# Altium project LCR.PrjPcb
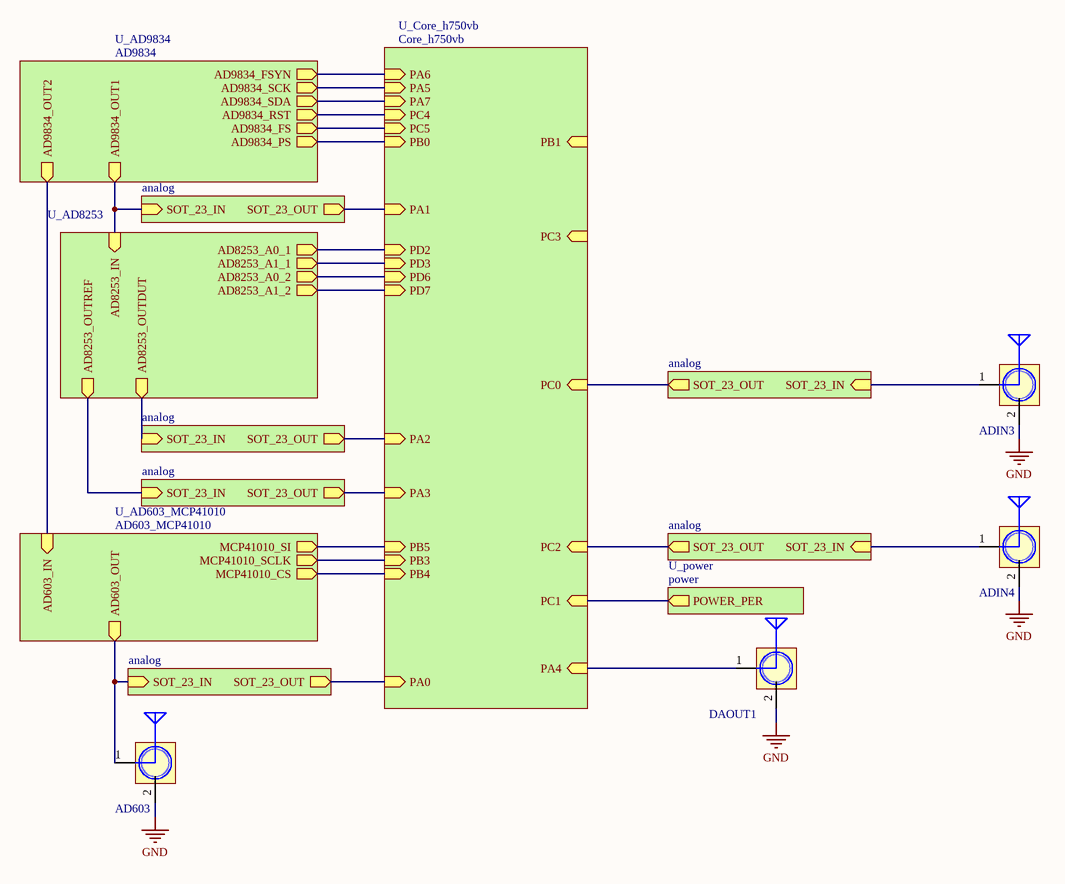
[diagram p0: Main.SchDoc]
8 sheets, 522 parts. Net scope: hierarchical (ports join the sheet entries above them; power ports are global).
Board file: LCR.PcbDoc
Sheets:
  Main.SchDoc
    U_AD603_MCP41010 = AD603_MCP41010.SchDoc
    U_AD8253 = AD8253.SchDoc
    U_AD9834 = AD9834.SchDoc
     = analog.SchDoc
    U_Core_h750vb = Core_h750vb.SchDoc
    U_power = power.SchDoc
     = analog.SchDoc
     = analog.SchDoc
     = analog.SchDoc
     = analog.SchDoc
     = analog.SchDoc
  Sheet1.SchDoc
    U_AD603_MCP41010 = AD603_MCP41010.SchDoc
    U_AD8253 = AD8253.SchDoc
    U_AD9834 = AD9834.SchDoc
    U_Core_h750vb = Core_h750vb.SchDoc
    U_power = power.SchDoc
     = analog.SchDoc
     = analog.SchDoc

## Sheet Main.SchDoc
size A4

### Parts
AD603  SMA WIFI 天线接口  [SMA]  (value not drawn)
ADIN3  SMA WIFI 天线接口  [SMA]  (value not drawn)
ADIN4  SMA WIFI 天线接口  [SMA]  (value not drawn)
DAOUT1  SMA WIFI 天线接口  [SMA]  (value not drawn)

### Sub-sheets
U_AD603_MCP41010 = AD603_MCP41010: AD603_OUT (out), MCP41010_SI (out), MCP41010_SCLK (out), MCP41010_CS (out), AD603_IN (in)
U_AD8253 = AD8253: AD8253_A0_1 (out), AD8253_A1_1 (out), AD8253_A0_2 (out), AD8253_A1_2 (out), AD8253_OUTDUT (out), AD8253_OUTREF (out), AD8253_IN (in)
U_AD9834 = AD9834: AD9834_FSYN (out), AD9834_SCK (out), AD9834_SDA (out), AD9834_RST (out), AD9834_FS (out), AD9834_PS (out), AD9834_OUT1 (out), AD9834_OUT2 (out)
U_Core_h750vb = Core_h750vb: PA6 (in), PA5 (in), PA7 (in), PC4 (in), PC5 (in), PB0 (in), PB5 (in), PB3 (in), PD2 (in), PD3 (in), PD6 (in), PD7 (in), PA1 (in), PA2 (in), PA3 (in), PC0 (in), PC1 (in), PC2 (in), PC3 (in), PA0 (in), PB1 (in), PB4 (in), PA4 (in)
U_power = power: POWER_PER (out)
? = analog: SOT_23_OUT (out), SOT_23_IN (in)
? = analog: SOT_23_OUT (out), SOT_23_IN (in)
? = analog: SOT_23_IN (in), SOT_23_OUT (out)
? = analog: SOT_23_IN (in), SOT_23_OUT (out)
? = analog: SOT_23_IN (in), SOT_23_OUT (out)
? = analog: SOT_23_IN (in), SOT_23_OUT (out)

### Nets
GND: AD603.2 ADIN3.2 ADIN4.2 DAOUT1.2
A0_1: sheet U_AD8253/AD8253_A0_1, sheet U_Core_h750vb/PD2
A0_2: sheet U_AD8253/AD8253_A0_2, sheet U_Core_h750vb/PD6
A1_1: sheet U_AD8253/AD8253_A1_1, sheet U_Core_h750vb/PD3
A1_2: sheet U_AD8253/AD8253_A1_2, sheet U_Core_h750vb/PD7
AD603_IN: sheet U_AD603_MCP41010/AD603_IN, sheet U_AD9834/AD9834_OUT2
AD603_OUT: AD603.1(SINGLE) ; sheet U_AD603_MCP41010/AD603_OUT, sheet /SOT_23_IN
AD8253_IN: sheet U_AD8253/AD8253_IN, sheet U_AD9834/AD9834_OUT1, sheet /SOT_23_IN
AD8253_OUTDUT: sheet U_AD8253/AD8253_OUTDUT, sheet /SOT_23_IN
AD8253_OUTREF: sheet U_AD8253/AD8253_OUTREF, sheet /SOT_23_IN
~{CS}: sheet U_AD603_MCP41010/MCP41010_CS, sheet U_Core_h750vb/PB4
FS: sheet U_AD9834/AD9834_FS, sheet U_Core_h750vb/PC5
FSYN: sheet U_AD9834/AD9834_FSYN, sheet U_Core_h750vb/PA6
PA0: sheet U_Core_h750vb/PA0, sheet /SOT_23_OUT
PA1: sheet U_Core_h750vb/PA1, sheet /SOT_23_OUT
PA2: sheet U_Core_h750vb/PA2, sheet /SOT_23_OUT
PA3: sheet U_Core_h750vb/PA3, sheet /SOT_23_OUT
PA4: DAOUT1.1(SINGLE) ; sheet U_Core_h750vb/PA4
PA5: sheet U_AD9834/AD9834_SCK, sheet U_Core_h750vb/PA5
PA7: sheet U_AD9834/AD9834_SDA, sheet U_Core_h750vb/PA7
PB0: sheet U_AD9834/AD9834_PS, sheet U_Core_h750vb/PB0
PB3: sheet U_AD603_MCP41010/MCP41010_SCLK, sheet U_Core_h750vb/PB3
PB5: sheet U_AD603_MCP41010/MCP41010_SI, sheet U_Core_h750vb/PB5
PC0: sheet U_Core_h750vb/PC0, sheet /SOT_23_OUT
PC1: sheet U_Core_h750vb/PC1, sheet U_power/POWER_PER
PC2: sheet /SOT_23_OUT, sheet U_Core_h750vb/PC2
PC4: sheet U_AD9834/AD9834_RST, sheet U_Core_h750vb/PC4
SOT_23_IN: ADIN3.1(SINGLE) ; sheet /SOT_23_IN
SOT_23_IN: ADIN4.1(SINGLE) ; sheet /SOT_23_IN  [a separate net that carries the same name]

### Library data of the parts
AD603 ADIN3 ADIN4 DAOUT1 = PORT_SMA: SMA-2.4G射频天线接口; 版权归属: 源创客; BOM名称: SMA-2.4G射频天线接口; 学习资源: www.ooocke.com

## Sheet AD603_MCP41010.SchDoc
size A4
Used 2 times, as channels U_AD603_MCP41010, U_AD603_MCP41010. Parts and nets are listed once, with the designators drawn on the sheet.
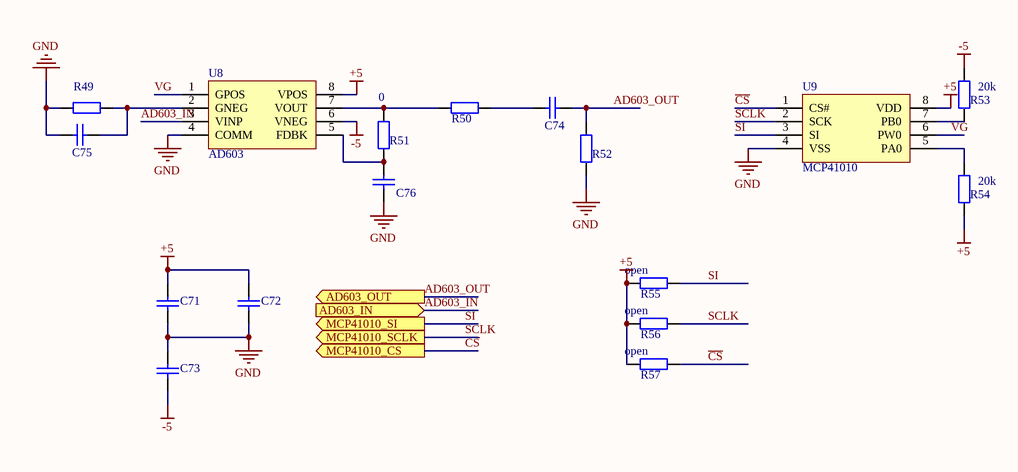
[diagram p1: AD603_MCP41010.SchDoc]

### Parts
C71  100nF (104) 10% 50V  [0603_C]  (value not drawn)
C72  100nF (104) 10% 50V  [0603_C]  (value not drawn)
C73  100nF (104) 10% 50V  [0603_C]  (value not drawn)
C74  100nF (104) 10% 50V  [0603_C]  (value not drawn)
C75  100nF (104) 10% 50V  [0603_C]  (value not drawn)
C76  10pf  [0603_C]  (value not drawn)
R49  10KΩ (1002) ±1%  [0603_R]  (value not drawn)
R50  10KΩ (1002) ±1%  [0603_R]  (value not drawn)
R51  0  [0603_R]
R52  10KΩ (1002) ±1%  [0603_R]  (value not drawn)
R53  20k  [0603_R]
R54  20k  [0603_R]
R55  open  [0603_R]
R56  open  [0603_R]
R57  open  [0603_R]
U8  AD603  [SO-8]
U9  MCP41010  [SOIC-8]

### Ports
AD603_IN (in), AD603_OUT (out), MCP41010_CS (out), MCP41010_SCLK (out), MCP41010_SI (out)

### Nets
+5: C71.2 C72.2 R54.2 R55.1 R56.1 R57.1 U8.8(VPOS) U9.8(VDD)
-5: C73.1 R53.1 U8.6(VNEG)
GND: C71.1 C72.1 C73.2 C75.2 C76.2 R49.2 R52.1 U8.4(COMM) U9.4(VSS)
AD603_IN: U8.3(VINP) ; port AD603_IN
AD603_OUT: C74.1 R52.2 ; port AD603_OUT
~{CS}: R57.2 U9.1(CS#) ; port MCP41010_CS
SCLK: R56.2 U9.2(SCK) ; port MCP41010_SCLK
SI: R55.2 U9.3(SI) ; port MCP41010_SI
VG: U8.1(GPOS) U9.6(PW0)
NetC74_2: C74.2 R50.2
NetC75_1: C75.1 R49.1 U8.2(GNEG)
NetC76_1: C76.1 R51.2 U8.5(FDBK)
NetR50_1: R50.1 R51.1 U8.7(VOUT)
NetR53_2: R53.2 U9.7(PB0)
NetR54_1: R54.1 U9.5(PA0)

### Channels
U_AD603_MCP41010: designators end in _U_AD603_MCP41010#1; ports AD603_IN=AD603_IN AD603_OUT=AD603_OUT MCP41010_CS=~{CS} MCP41010_SCLK=PB3 MCP41010_SI=PB5
U_AD603_MCP41010: designators end in _U_AD603_MCP41010#2; ports AD603_IN=AD603_IN AD603_OUT=AD603_OUT MCP41010_CS=~{CS} MCP41010_SCLK=PB3 MCP41010_SI=PB5

### Library data of the parts
C71-C76 = 0603 100nF (104) 10% 50V: 贴片电容; ComponentLink1Description: 供应商链接; ComponentLink1URL: http://www.szlcsc.com/product/details_15331.html; Package: 0603; Supplier: LC; SuppliersPartNumber: C14663
R49-R57 = 0603 10KΩ (1002) 1%: 贴片电阻; ComponentLink1Description: 供应商链接; ComponentLink1URL: http://www.szlcsc.com/product/details_26547.html; Package: 0603; Supplier: LC; SuppliersPartNumber: C25804
U9 = IC_MCP41010T

## Sheet AD8253.SchDoc
size A4
Used 2 times, as channels U_AD8253, U_AD8253. Parts and nets are listed once, with the designators drawn on the sheet.
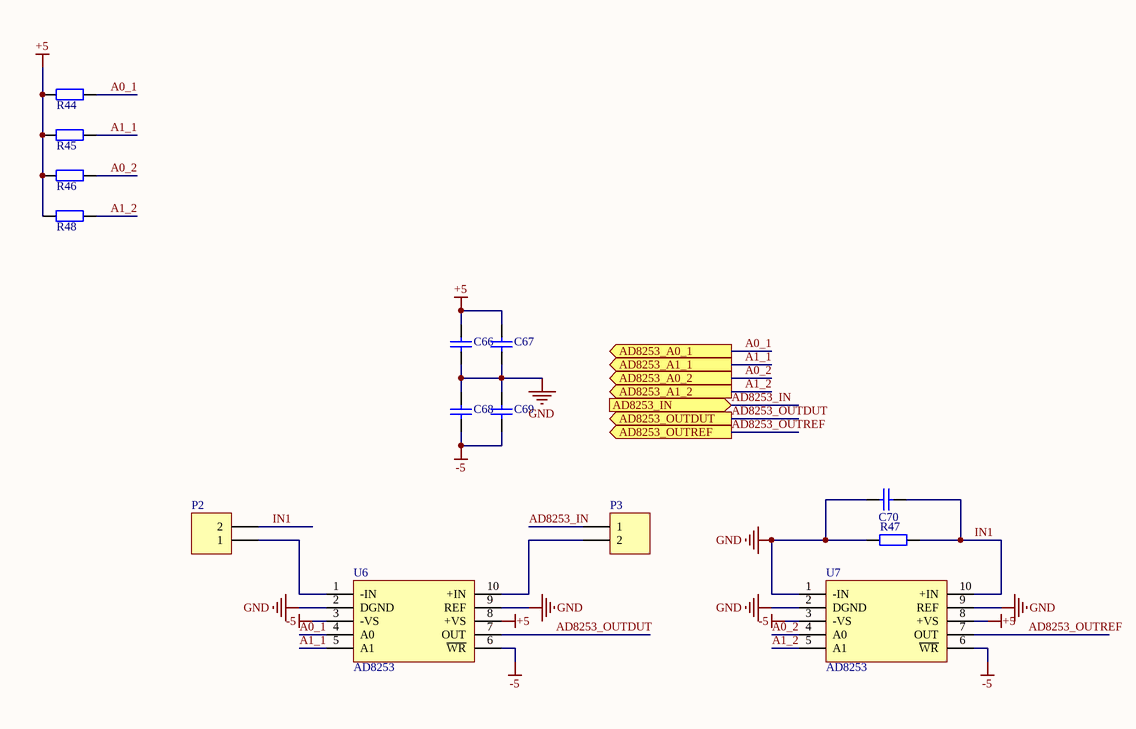
[diagram p2: AD8253.SchDoc]

### Parts
C66  100nF (104) 10% 50V  [0603_C]  (value not drawn)
C67  100nF (104) 10% 50V  [0603_C]  (value not drawn)
C68  100nF (104) 10% 50V  [0603_C]  (value not drawn)
C69  100nF (104) 10% 50V  [0603_C]  (value not drawn)
C70  1.5nF (152) 10% 50V  [0603_C]  (value not drawn)
P2  PORT_Header 2  [tow_pad_top]  (value not drawn)
P3  PORT_Header 2  [tow_pad_top]  (value not drawn)
R44  110Ω (1100) ±1%  [0603_R]  (value not drawn)
R45  110Ω (1100) ±1%  [0603_R]  (value not drawn)
R46  110Ω (1100) ±1%  [0603_R]  (value not drawn)
R47  110Ω (1100) ±1%  [0603_R]  (value not drawn)
R48  110Ω (1100) ±1%  [0603_R]  (value not drawn)
U6  AD8253  [MSOP10_M]
U7  AD8253  [MSOP10_M]

### Ports
AD8253_A0_1 (out), AD8253_A0_2 (out), AD8253_A1_1 (out), AD8253_A1_2 (out), AD8253_IN (in), AD8253_OUTDUT (out), AD8253_OUTREF (out)

### Nets
+5: C66.2 C67.2 R44.2 R45.2 R46.2 R48.2 U6.8(+VS) U7.8(+VS)
-5: C68.1 C69.1 U6.3(-VS) U6.6(~{WR}) U7.3(-VS) U7.6(~{WR})
GND: C66.1 C67.1 C68.2 C69.2 C70.2 R47.1 U6.2(DGND) U6.9(REF) U7.1(-IN) U7.2(DGND) U7.9(REF)
A0_1: R44.1 U6.4(A0) ; port AD8253_A0_1
A0_2: R46.1 U7.4(A0) ; port AD8253_A0_2
A1_1: R45.1 U6.5(A1) ; port AD8253_A1_1
A1_2: R48.1 U7.5(A1) ; port AD8253_A1_2
AD8253_IN: P3.1 ; port AD8253_IN
AD8253_OUTDUT: U6.7(OUT) ; port AD8253_OUTDUT
AD8253_OUTREF: U7.7(OUT) ; port AD8253_OUTREF
IN1: C70.1 P2.2 R47.2 U7.10(+IN)
NetP2_1: P2.1 U6.1(-IN)
NetP3_2: P3.2 U6.10(+IN)

### Channels
U_AD8253: designators end in _U_AD8253#1; ports AD8253_A0_1=A0_1 AD8253_A0_2=A0_2 AD8253_A1_1=A1_1 AD8253_A1_2=A1_2 AD8253_IN=AD8253_IN AD8253_OUTDUT=AD8253_OUTDUT AD8253_OUTREF=AD8253_OUTREF
U_AD8253: designators end in _U_AD8253#2; ports AD8253_A0_1=A0_1 AD8253_A0_2=A0_2 AD8253_A1_1=A1_1 AD8253_A1_2=A1_2 AD8253_IN=AD603_OUT AD8253_OUTDUT=AD8253_OUTDUT AD8253_OUTREF=AD8253_OUTREF

### Library data of the parts
C66-C69 = 0603 100nF (104) 10% 50V: 贴片电容; ComponentLink1Description: 供应商链接; ComponentLink1URL: http://www.szlcsc.com/product/details_15331.html; Package: 0603; Supplier: LC; SuppliersPartNumber: C14663
C70 = 0603 1.5nF (152) 10% 50V: 贴片电容; ComponentLink1Description: 供应商链接; ComponentLink1URL: http://www.szlcsc.com/product/details_1947.html; Package: 0603; Supplier: LC; SuppliersPartNumber: C1595
P2 P3 = PORT_Header 2: Header, 2-Pin; LatestRevisionDate: 17-Jul-2002; LatestRevisionNote: Re-released for DXP Platform.; Publisher: Altium Limited
R44-R48 = 0603 110Ω (1100) 1%: 贴片电阻; ComponentLink1Description: 供应商链接; ComponentLink1URL: http://www.szlcsc.com/product/details_23508.html; Package: 0603; Supplier: LC; SuppliersPartNumber: C22781

## Sheet AD9834.SchDoc
size A4
Used 2 times, as channels U_AD9834, U_AD9834. Parts and nets are listed once, with the designators drawn on the sheet.
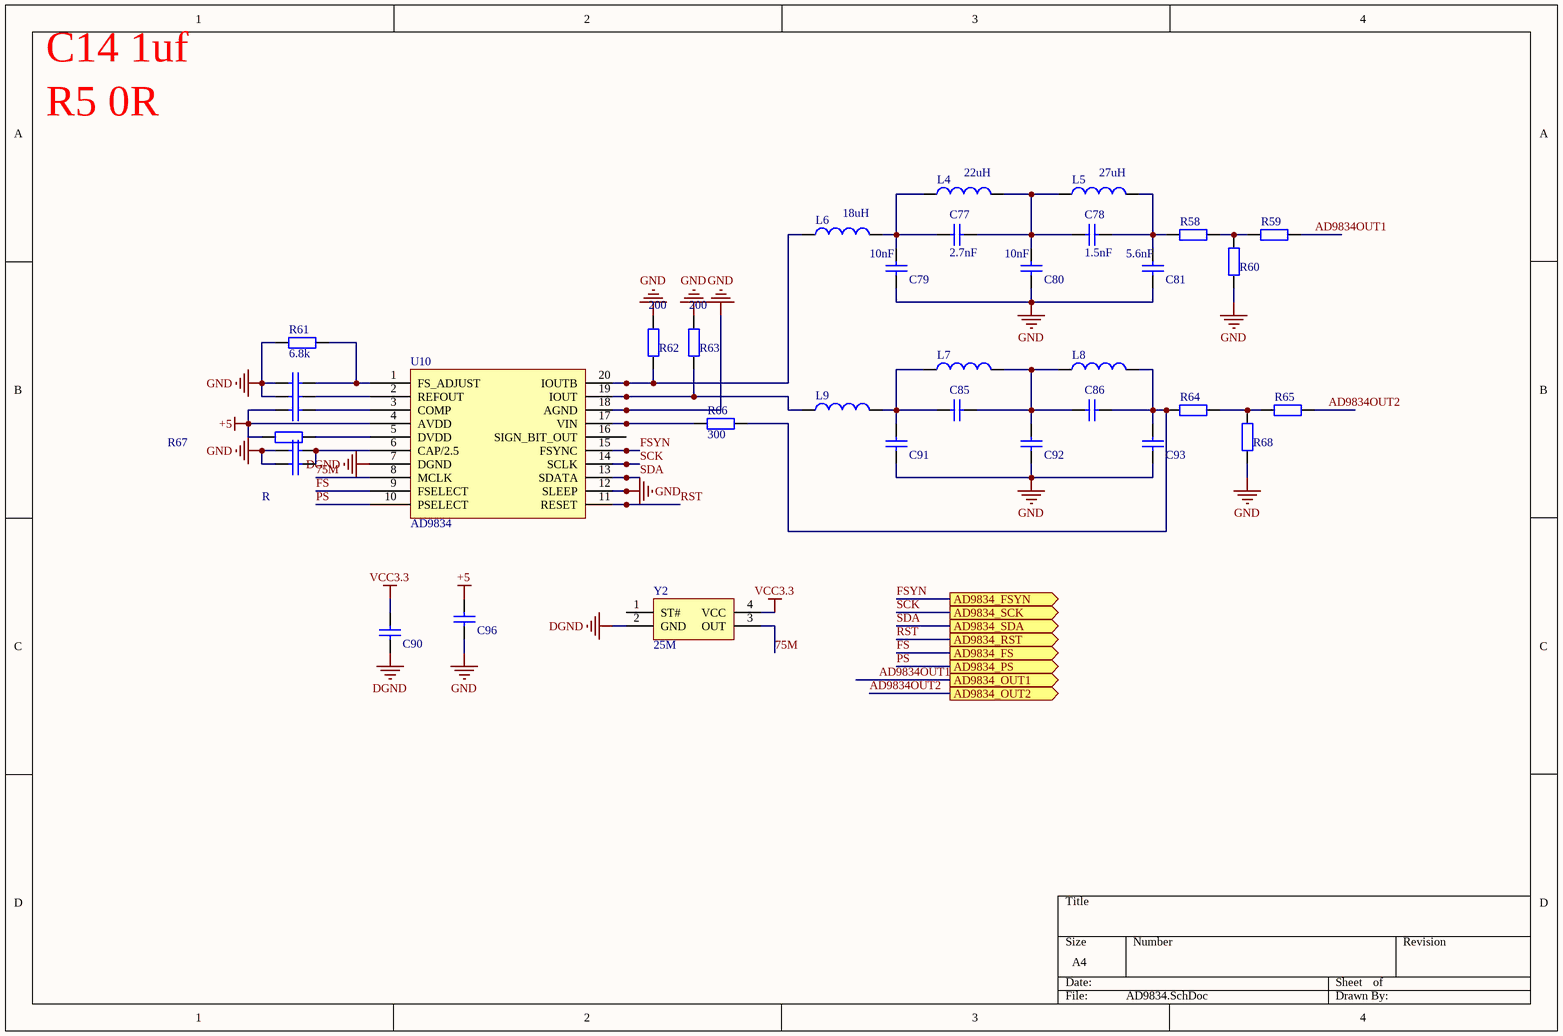
[diagram p3: AD9834.SchDoc]

### Parts
C77  2.7nF  [0603_C]
C78  1.5nF  [0603_C]
C79  10nF  [0603_C]
C80  10nF  [0603_C]
C81  5.6nF  [0603_C]
C82  10nF (103) 10% 50V  [0603_C]  (value not drawn)
C83  10nF (103) 10% 50V  [0603_C]  (value not drawn)
C84  10nF (103) 10% 50V  [0603_C]  (value not drawn)
C85  10nF (103) 10% 50V  [0603_C]  (value not drawn)
C86  10nF (103) 10% 50V  [0603_C]  (value not drawn)
C87  10nF (103) 10% 50V  [0603_C]  (value not drawn)
C89  10nF (103) 10% 50V  [0603_C]  (value not drawn)
C90  10nF (103) 10% 50V  [0603_C]  (value not drawn)
C91  10nF (103) 10% 50V  [0603_C]  (value not drawn)
C92  10nF (103) 10% 50V  [0603_C]  (value not drawn)
C93  10nF (103) 10% 50V  [0603_C]  (value not drawn)
C96  10nF (103) 10% 50V  [0603_C]  (value not drawn)
L4  22uH  [0603_L]
L5  27uH  [0603_L]
L6  18uH  [0603_L]
L7  699.1nH  [0603_L]  (value not drawn)
L8  596.4nH  [0603_L]  (value not drawn)
L9  22uH  [0603_L]  (value not drawn)
R58  110Ω (1100) ±1%  [0603_R]  (value not drawn)
R59  110Ω (1100) ±1%  [0603_R]  (value not drawn)
R60  110Ω (1100) ±1%  [0603_R]  (value not drawn)
R61  6.8k  [0603_R]
R62  200  [0603_R]
R63  200  [0603_R]
R64  110Ω (1100) ±1%  [0603_R]  (value not drawn)
R65  110Ω (1100) ±1%  [0603_R]  (value not drawn)
R66  300  [0603_R]
R67  R  [R_0603]
R68  110Ω (1100) ±1%  [0603_R]  (value not drawn)
U10  AD9834  [TSSOP20_N]
Y2  value 25M  [OSC 3225-4P]  (hidden comment: CRYSTAL)

### Ports
AD9834_FS (out), AD9834_FSYN (out), AD9834_OUT1 (out), AD9834_OUT2 (out), AD9834_PS (out), AD9834_RST (out), AD9834_SCK (out), AD9834_SDA (out)

### Nets
+5: C84.1 C96.2 R67.1 U10.4(AVDD)
DGND: C90.1 U10.7(DGND) Y2.2(GND)
GND: C79.1 C80.1 C81.1 C82.1 C83.1 C87.1 C89.1 C91.1 C92.1 C93.1 C96.1 R60.1 R61.2 R62.2 R63.2 R68.1 U10.12(SLEEP) U10.18(AGND)
VCC3.3: C90.2 Y2.4(VCC)
75M: U10.8(MCLK) Y2.3(OUT)
AD9834OUT1: R59.2 ; port AD9834_OUT1
AD9834OUT2: R65.2 ; port AD9834_OUT2
FS: U10.9(FSELECT) ; port AD9834_FS
FSYN: U10.15(FSYNC) ; port AD9834_FSYN
PS: U10.10(PSELECT) ; port AD9834_PS
RST: U10.11(RESET) ; port AD9834_RST
SCK: U10.14(SCLK) ; port AD9834_SCK
SDA: U10.13(SDATA) ; port AD9834_SDA
NetC77_1: C77.1 C79.2 L4.1 L6.2
NetC77_2: C77.2 C78.1 C80.2 L4.2 L5.1
NetC78_2: C78.2 C81.2 L5.2 R58.1
NetC82_2: C82.2 R61.1 U10.1(FS_ADJUST)
NetC83_2: C83.2 U10.2(REFOUT)
NetC84_2: C84.2 U10.3(COMP)
NetC85_1: C85.1 C91.2 L7.1 L9.2
NetC85_2: C85.2 C86.1 C92.2 L7.2 L8.1
NetC86_2: C86.2 C93.2 L8.2 R64.1 R66.2
NetC87_2: C87.2 C89.2 U10.6(CAP/2.5)
NetL6_1: L6.1 R62.1 U10.20(IOUTB)
NetL9_1: L9.1 R63.1 U10.19(IOUT)
NetR58_2: R58.2 R59.1 R60.2
NetR64_2: R64.2 R65.1 R68.2
NetR66_1: R66.1 U10.17(VIN)
NetR67_2: R67.2 U10.5(DVDD)

Not connected (* = marked no-connect by the designer): U10 16(SIGN_BIT_OUT); Y2 1(ST#)

### Channels
U_AD9834: designators end in _U_AD9834#1; ports AD9834_FS=FS AD9834_FSYN=FSYN AD9834_OUT1=AD8253_IN AD9834_OUT2=AD603_IN AD9834_PS=PB0 AD9834_RST=PC4 AD9834_SCK=PA5 AD9834_SDA=PA7
U_AD9834: designators end in _U_AD9834#2; ports AD9834_FS=FS AD9834_FSYN=FSYN AD9834_OUT1=AD603_IN AD9834_OUT2=AD9834OUT2_U_AD9834 AD9834_PS=PB0 AD9834_RST=PC4 AD9834_SCK=PA5 AD9834_SDA=PA7

### Notes on the sheet
- C14 1uf
- R5 0R

### Library data of the parts
C77-C87 C89-C93 C96 = 0603 10nF (103) 10% 50V: 贴片电容; ComponentLink1Description: 供应商链接; ComponentLink1URL: http://www.szlcsc.com/product/details_58143.html; Package: 0603; Supplier: LC; SuppliersPartNumber: C57112
L4-L9 = Inductor: Code_IEC: 1005; Value: 10mH; Published: 8-Jun-2000; LatestRevisionDate: 29-May-2009; LatestRevisionNote: IPC-7351 Footprint Added.; PackageReference: 0402-A; Publisher: Altium Limited; PackageDescription: Chip Inductor; Code_JEITA: 0402
R58-R66 R68 = 0603 110Ω (1100) 1%: 贴片电阻; ComponentLink1Description: 供应商链接; ComponentLink1URL: http://www.szlcsc.com/product/details_23508.html; Package: 0603; Supplier: LC; SuppliersPartNumber: C22781
R67 = Res
Y2 = CRYSTAL_有源晶振-25M-3225-4P

## Sheet analog.SchDoc
size A4
Used 8 times, as channels , , , , , , , . Parts and nets are listed once, with the designators drawn on the sheet.
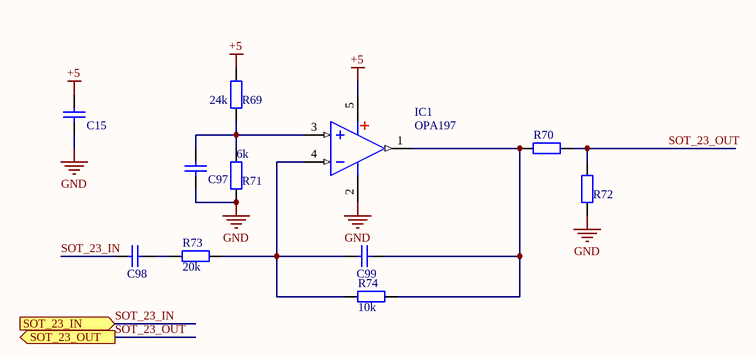
[diagram p4: analog.SchDoc]

### Parts
C15  10nF (103) 10% 50V  [0603_C]  (value not drawn)
C97  100nF (104) 10% 50V  [0603_C]  (value not drawn)
C98  100nF (104) 10% 50V  [0603_C]  (value not drawn)
C99  100nF (104) 10% 50V  [0603_C]  (value not drawn)
IC1  OPA197  [SOT23-5N]
R69  24k  [0603_R]
R70  110Ω (1100) ±1%  [0603_R]  (value not drawn)
R71  6k  [0603_R]
R72  110Ω (1100) ±1%  [0603_R]  (value not drawn)
R73  20k  [0603_R]
R74  10k  [0603_R]

### Ports
SOT_23_IN (in), SOT_23_OUT (out)

### Nets
+5: C15.2 IC1.5(V+) R69.2
GND: C15.1 C97.2 IC1.2(V-) R71.1 R72.1
SOT_23_IN: C98.1 ; port SOT_23_IN
SOT_23_OUT: R70.2 R72.2 ; port SOT_23_OUT
NetC97_1: C97.1 IC1.3(IN+) R69.1 R71.2
NetC98_2: C98.2 R73.1
NetC99_1: C99.1 IC1.1(OUT) R70.1 R74.2
NetC99_2: C99.2 IC1.4(IN-) R73.2 R74.1

### Channels
(top): designators end in _#1; ports SOT_23_IN=SOT_23_IN SOT_23_OUT=PC2
(top): designators end in _#2; ports SOT_23_IN=SOT_23_IN SOT_23_OUT=PC0
(top): designators end in _#3; ports SOT_23_IN=AD8253_OUTDUT SOT_23_OUT=PA2
(top): designators end in _#4; ports SOT_23_IN=AD8253_OUTREF SOT_23_OUT=PA3
(top): designators end in _#5; ports SOT_23_IN=AD603_OUT SOT_23_OUT=PA0
(top): designators end in _#6; ports SOT_23_IN=AD8253_IN SOT_23_OUT=PA1
(top): designators end in _#7; ports SOT_23_IN=AD8253_OUTDUT SOT_23_OUT=PA2
(top): designators end in _#8; ports SOT_23_IN=AD8253_OUTREF SOT_23_OUT=PA3

### Library data of the parts
C15 = 0603 10nF (103) 10% 50V: 贴片电容; ComponentLink1Description: 供应商链接; ComponentLink1URL: http://www.szlcsc.com/product/details_58143.html; Package: 0603; Supplier: LC; SuppliersPartNumber: C57112
C97-C99 = 0603 100nF (104) 10% 50V: 贴片电容; ComponentLink1Description: 供应商链接; ComponentLink1URL: http://www.szlcsc.com/product/details_15331.html; Package: 0603; Supplier: LC; SuppliersPartNumber: C14663
IC1 = SGM8521-5Pin: SOT23-5_轨至轨运放; BOM名称: 轨至轨运放; 版权归属: 源创客; 学习资源: www.ooocke.com
R69-R74 = 0603 110Ω (1100) 1%: 贴片电阻; ComponentLink1Description: 供应商链接; ComponentLink1URL: http://www.szlcsc.com/product/details_23508.html; Package: 0603; Supplier: LC; SuppliersPartNumber: C22781

## Sheet Core_h750vb.SchDoc
size A3
Used 2 times, as channels U_Core_h750vb, U_Core_h750vb. Parts and nets are listed once, with the designators drawn on the sheet.
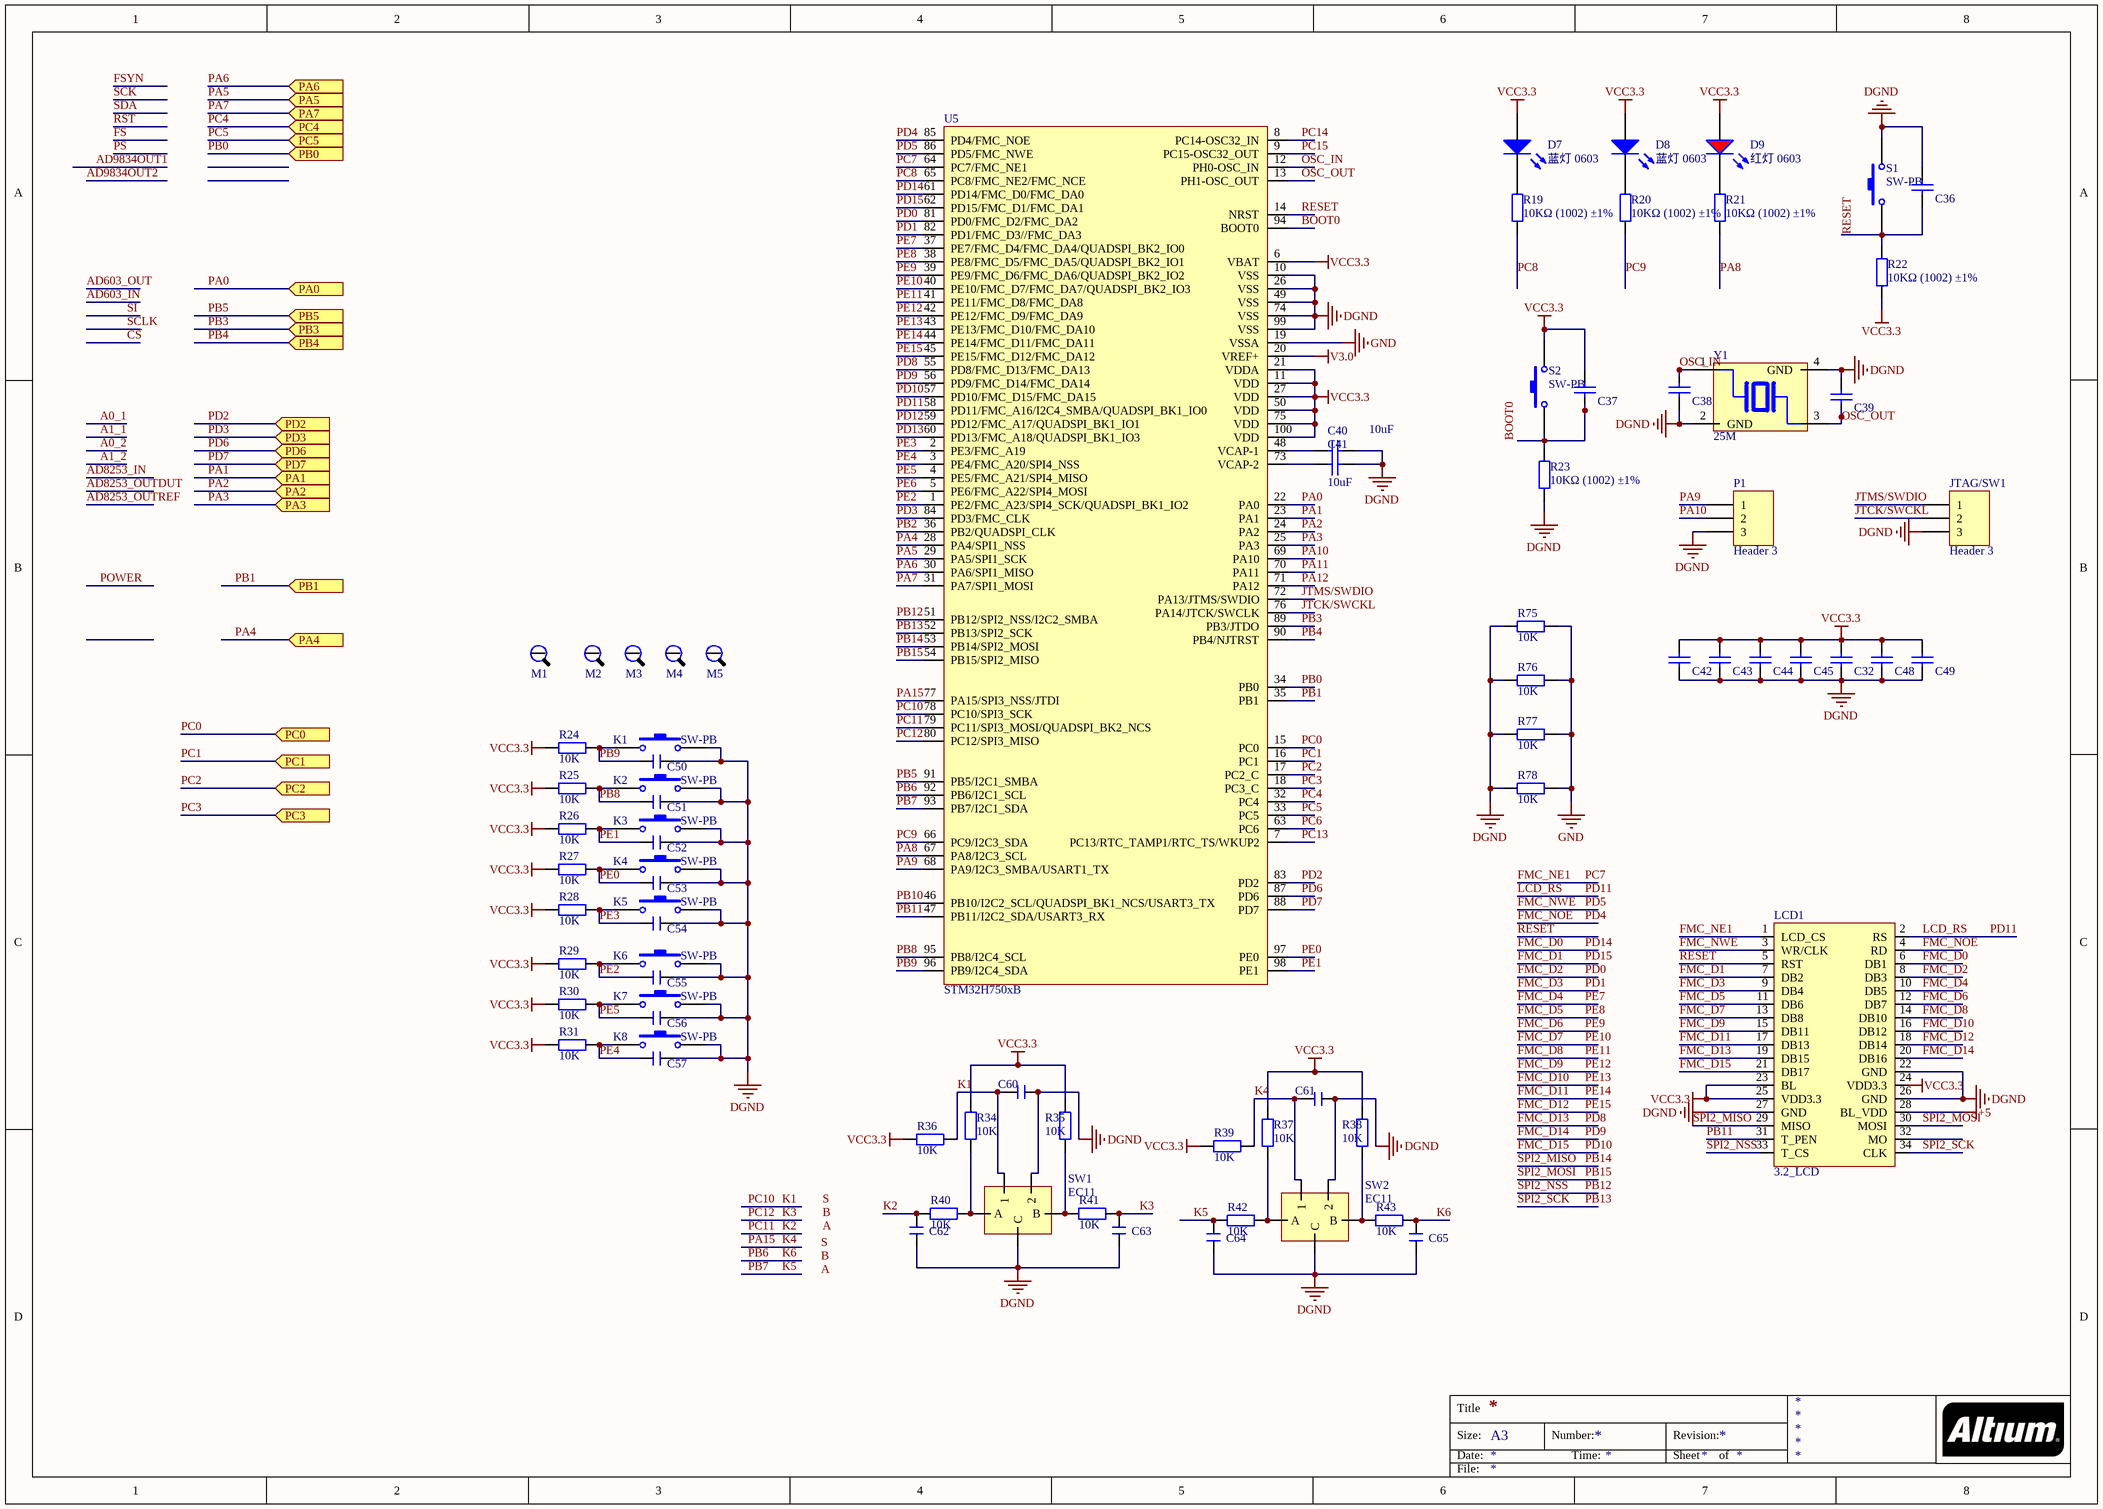
[diagram p5: Core_h750vb.SchDoc]

### Parts
C32  100nF (104) 10% 50V  [0603_C]  (value not drawn)
C36  100nF (104) 10% 50V  [0603_C]  (value not drawn)
C37  100nF (104) 10% 50V  [0603_C]  (value not drawn)
C38  100nF (104) 10% 50V  [0603_C]  (value not drawn)
C39  100nF (104) 10% 50V  [0603_C]  (value not drawn)
C40  10uF  [0603_C]
C41  10uF  [0603_C]
C42  100nF (104) 10% 50V  [0603_C]  (value not drawn)
C43  100nF (104) 10% 50V  [0603_C]  (value not drawn)
C44  100nF (104) 10% 50V  [0603_C]  (value not drawn)
C45  100nF (104) 10% 50V  [0603_C]  (value not drawn)
C48  100nF (104) 10% 50V  [0603_C]  (value not drawn)
C49  100nF (104) 10% 50V  [0603_C]  (value not drawn)
C50  104  [0603_C]  (value not drawn)
C51  104  [0603_C]  (value not drawn)
C52  104  [0603_C]  (value not drawn)
C53  104  [0603_C]  (value not drawn)
C54  104  [0603_C]  (value not drawn)
C55  104  [0603_C]  (value not drawn)
C56  104  [0603_C]  (value not drawn)
C57  104  [0603_C]  (value not drawn)
C60  104  [0603_C]  (value not drawn)
C61  104  [0603_C]  (value not drawn)
C62  104  [0603_C]  (value not drawn)
C63  104  [0603_C]  (value not drawn)
C64  104  [0603_C]  (value not drawn)
C65  104  [0603_C]  (value not drawn)
D7  蓝灯 0603  [0603_LED_S1]
D8  蓝灯 0603  [0603_LED_S1]
D9  红灯 0603  [0603_LED_S1]
JTAG/SW1  Header 3  [HDR1X3]
K1  SW-PB  [SW_PB2_A1]
K2  SW-PB  [SW_PB2_A1]
K3  SW-PB  [SW_PB2_A1]
K4  SW-PB  [SW_PB2_A1]
K5  SW-PB  [SW_PB2_A1]
K6  SW-PB  [SW_PB2_A1]
K7  SW-PB  [SW_PB2_A1]
K8  SW-PB  [SW_PB2_A1]
LCD1  3.2_LCD  [LCD_3.2]
M1  M3  [M3x10_L]  (value not drawn)
M2  M3  [M3x10_L]  (value not drawn)
M3  M3  [M3x10_L]  (value not drawn)
M4  M3  [M3x10_L]  (value not drawn)
M5  M3  [M3x10_L]  (value not drawn)
P1  Header 3  [HDR1X3]
R19  10KΩ (1002) ±1%  [0603_R]
R20  10KΩ (1002) ±1%  [0603_R]
R21  10KΩ (1002) ±1%  [0603_R]
R22  10KΩ (1002) ±1%  [0603_R]
R23  10KΩ (1002) ±1%  [0603_R]
R24  10K  [0603-1]
R25  10K  [0603-1]
R26  10K  [0603-1]
R27  10K  [0603-1]
R28  10K  [0603-1]
R29  10K  [0603-1]
R30  10K  [0603-1]
R31  10K  [0603-1]
R34  10K  [0603-1]
R35  10K  [0603-1]
R36  10K  [0603-1]
R37  10K  [0603-1]
R38  10K  [0603-1]
R39  10K  [0603-1]
R40  10K  [0603-1]
R41  10K  [0603-1]
R42  10K  [0603-1]
R43  10K  [0603-1]
R75  10K  [0603-1]
R76  10K  [0603-1]
R77  10K  [0603-1]
R78  10K  [0603-1]
S1  SW-PB  [SW_PB2_A1]
S2  SW-PB  [SW_PB2_A1]
SW1  EC11  [EC11]
SW2  EC11  [EC11]
U5  STM32H750xB  [TQFP100_M]
Y1  value 25M  [OSC 3225-4P]  (hidden comment: CRYSTAL)

### Ports
PA0 (in), PA1 (in), PA2 (in), PA3 (in), PA4 (in), PA5 (in), PA6 (in), PA7 (in), PB0 (in), PB1 (in), PB3 (in), PB4 (in), PB5 (in), PC0 (in), PC1 (in), PC2 (in), PC3 (in), PC4 (in), PC5 (in), PD2 (in), PD3 (in), PD6 (in), PD7 (in)

### Nets
+5: LCD1.28(BL_VDD)
DGND: C32.2 C36.1 C38.2 C39.1 C40.1 C41.1 C42.2 C43.2 C44.2 C45.2 C48.2 C49.2 C50.2 C51.2 C52.2 C53.2 C54.2 C55.2 C56.2 C57.2 C60.1 C61.1 C62.2 C63.2 C64.2 C65.2 JTAG/SW1.3 K1.2 K2.2 K3.2 K4.2 K5.2 K6.2 K7.2 K8.2 LCD1.22(GND) LCD1.26(GND) LCD1.27(GND) P1.3 R23.1 R75.2 R76.2 R77.2 R78.2 S1.2 SW1.2 SW1.C SW2.2 SW2.C U5.10(VSS) U5.26(VSS) U5.49(VSS) U5.74(VSS) U5.99(VSS) Y1.2(GND) Y1.4(GND)
GND: R75.1 R76.1 R77.1 R78.1 U5.19(VSSA)
V3.0: U5.20(VREF+)
VCC3.3: C32.1 C37.1 C42.1 C43.1 C44.1 C45.1 C48.1 C49.1 D7.A D8.A D9.A LCD1.23(BL) LCD1.24(VDD3.3) LCD1.25(VDD3.3) R22.1 R24.2 R25.2 R26.2 R27.2 R28.2 R29.2 R30.2 R31.2 R34.2 R35.2 R36.1 R37.2 R38.2 R39.1 S2.2 U5.6(VBAT) U5.11(VDD) U5.21(VDDA) U5.27(VDD) U5.50(VDD) U5.75(VDD) U5.100(VDD)
BOOT0: C37.2 R23.2 S2.1 U5.94(BOOT0)
FMC_D0: LCD1.6(DB1) U5.61(PD14/FMC_D0/FMC_DA0)  [also labelled PD14]
FMC_D1: LCD1.7(DB2) U5.62(PD15/FMC_D1/FMC_DA1)  [also labelled PD15]
FMC_D2: LCD1.8(DB3) U5.81(PD0/FMC_D2/FMC_DA2)  [also labelled PD0]
FMC_D3: LCD1.9(DB4) U5.82(PD1/FMC_D3//FMC_DA3)  [also labelled PD1]
FMC_D4: LCD1.10(DB5) U5.37(PE7/FMC_D4/FMC_DA4/QUADSPI_BK2_IO0)  [also labelled PE7]
FMC_D5: LCD1.11(DB6) U5.38(PE8/FMC_D5/FMC_DA5/QUADSPI_BK2_IO1)  [also labelled PE8]
FMC_D6: LCD1.12(DB7) U5.39(PE9/FMC_D6/FMC_DA6/QUADSPI_BK2_IO2)  [also labelled PE9]
FMC_D7: LCD1.13(DB8) U5.40(PE10/FMC_D7/FMC_DA7/QUADSPI_BK2_IO3)  [also labelled PE10]
FMC_D8: LCD1.14(DB10) U5.41(PE11/FMC_D8/FMC_DA8)  [also labelled PE11]
FMC_D9: LCD1.15(DB11) U5.42(PE12/FMC_D9/FMC_DA9)  [also labelled PE12]
FMC_D10: LCD1.16(DB12) U5.43(PE13/FMC_D10/FMC_DA10)  [also labelled PE13]
FMC_D11: LCD1.17(DB13) U5.44(PE14/FMC_D11/FMC_DA11)  [also labelled PE14]
FMC_D12: LCD1.18(DB14) U5.45(PE15/FMC_D12/FMC_DA12)  [also labelled PE15]
FMC_D13: LCD1.19(DB15) U5.55(PD8/FMC_D13/FMC_DA13)  [also labelled PD8]
FMC_D14: LCD1.20(DB16) U5.56(PD9/FMC_D14/FMC_DA14)  [also labelled PD9]
FMC_D15: LCD1.21(DB17) U5.57(PD10/FMC_D15/FMC_DA15)  [also labelled PD10]
FMC_NE1: LCD1.1(LCD_CS) U5.64(PC7/FMC_NE1)  [also labelled PC7]
FMC_NOE: LCD1.4(RD) U5.85(PD4/FMC_NOE)  [also labelled PD4]
FMC_NWE: LCD1.3(WR/CLK) U5.86(PD5/FMC_NWE)  [also labelled PD5]
JTCK/SWCKL: JTAG/SW1.2 U5.76(PA14/JTCK/SWCLK)
JTMS/SWDIO: JTAG/SW1.1 U5.72(PA13/JTMS/SWDIO)
K1: C60.2 R36.2 SW1.1 U5.78(PC10/SPI3_SCK)  [also labelled PC10]
K2: C62.1 R40.1 U5.79(PC11/SPI3_MOSI/QUADSPI_BK2_NCS)  [also labelled PC11]
K3: C63.1 R41.2 U5.80(PC12/SPI3_MISO)  [also labelled PC12]
K4: C61.2 R39.2 SW2.1 U5.77(PA15/SPI3_NSS/JTDI)  [also labelled PA15]
K5: C64.1 R42.1 U5.93(PB7/I2C1_SDA)  [also labelled PB7]
K6: C65.1 R43.2 U5.92(PB6/I2C1_SCL)  [also labelled PB6]
LCD_RS: LCD1.2(RS) U5.58(PD11/FMC_A16/I2C4_SMBA/QUADSPI_BK1_IO0)  [also labelled PD11]
OSC_IN: C38.1 U5.12(PH0-OSC_IN) Y1.1
OSC_OUT: C39.2 U5.13(PH1-OSC_OUT) Y1.3
PA0: U5.22(PA0) ; port PA0
PA1: U5.23(PA1) ; port PA1
PA2: U5.24(PA2) ; port PA2
PA3: U5.25(PA3) ; port PA3
PA4: U5.28(PA4/SPI1_NSS) ; port PA4
PA5: U5.29(PA5/SPI1_SCK) ; port PA5
PA6: U5.30(PA6/SPI1_MISO) ; port PA6
PA7: U5.31(PA7/SPI1_MOSI) ; port PA7
PA8: R21.1 U5.67(PA8/I2C3_SCL)
PA9: P1.1 U5.68(PA9/I2C3_SMBA/USART1_TX)
PA10: P1.2 U5.69(PA10)
PA11: U5.70(PA11)
PA12: U5.71(PA12)
PB0: U5.34(PB0) ; port PB0
PB1: U5.35(PB1) ; port PB1
PB2: U5.36(PB2/QUADSPI_CLK)
PB3: U5.89(PB3/JTDO) ; port PB3
PB4: U5.90(PB4/NJTRST) ; port PB4
PB5: U5.91(PB5/I2C1_SMBA) ; port PB5
PB8: C51.1 K2.1 R25.1 U5.95(PB8/I2C4_SCL)
PB9: C50.1 K1.1 R24.1 U5.96(PB9/I2C4_SDA)
PB10: U5.46(PB10/I2C2_SCL/QUADSPI_BK1_NCS/USART3_TX)
PB11: LCD1.31(T_PEN) U5.47(PB11/I2C2_SDA/USART3_RX)
PB12: LCD1.33(T_CS) U5.51(PB12/SPI2_NSS/I2C2_SMBA)  [also labelled SPI2_NSS]
PB13: LCD1.34(CLK) U5.52(PB13/SPI2_SCK)  [also labelled SPI2_SCK]
PB14: LCD1.29(MISO) U5.53(PB14/SPI2_MOSI)  [also labelled SPI2_MISO]
PB15: LCD1.30(MOSI) U5.54(PB15/SPI2_MISO)  [also labelled SPI2_MOSI]
PC0: U5.15(PC0) ; port PC0
PC1: U5.16(PC1) ; port PC1
PC2: U5.17(PC2_C) ; port PC2
PC3: U5.18(PC3_C) ; port PC3
PC4: U5.32(PC4) ; port PC4
PC5: U5.33(PC5) ; port PC5
PC6: U5.63(PC6)
PC8: R19.1 U5.65(PC8/FMC_NE2/FMC_NCE)
PC9: R20.1 U5.66(PC9/I2C3_SDA)
PC13: U5.7(PC13/RTC_TAMP1/RTC_TS/WKUP2)
PC14: U5.8(PC14-OSC32_IN)
PC15: U5.9(PC15-OSC32_OUT)
PD2: U5.83(PD2) ; port PD2
PD3: U5.84(PD3/FMC_CLK) ; port PD3
PD6: U5.87(PD6) ; port PD6
PD7: U5.88(PD7) ; port PD7
PD12: U5.59(PD12/FMC_A17/QUADSPI_BK1_IO1)
PD13: U5.60(PD13/FMC_A18/QUADSPI_BK1_IO3)
PE0: C53.1 K4.1 R27.1 U5.97(PE0)
PE1: C52.1 K3.1 R26.1 U5.98(PE1)
PE2: C55.1 K6.1 R29.1 U5.1(PE2/FMC_A23/SPI4_SCK/QUADSPI_BK1_IO2)
PE3: C54.1 K5.1 R28.1 U5.2(PE3/FMC_A19)
PE4: C57.1 K8.1 R31.1 U5.3(PE4/FMC_A20/SPI4_NSS)
PE5: C56.1 K7.1 R30.1 U5.4(PE5/FMC_A21/SPI4_MISO)
PE6: U5.5(PE6/FMC_A22/SPI4_MOSI)
RESET: C36.2 LCD1.5(RST) R22.2 S1.1 U5.14(NRST)
NetC40_2: C40.2 U5.48(VCAP-1)
NetC41_2: C41.2 U5.73(VCAP-2)
NetD7_K: D7.K R19.2
NetD8_K: D8.K R20.2
NetD9_K: D9.K R21.2
NetR34_1: R34.1 R40.2 SW1.A
NetR35_1: R35.1 R41.1 SW1.B
NetR37_1: R37.1 R42.2 SW2.A
NetR38_1: R38.1 R43.1 SW2.B

Not connected (* = marked no-connect by the designer): LCD1 32(MO); M1 1; M2 1; M3 1; M4 1; M5 1

### Channels
U_Core_h750vb: designators end in _U_Core_h750vb#1; ports PA0=PA0 PA1=PA1 PA2=PA2 PA3=PA3 PA4=PA4 PA5=PA5 PA6=FSYN PA7=PA7 PB0=PB0 PB1=PB1_U_Core_h750vb PB3=PB3 PB4=~{CS} PB5=PB5 PC0=PC0 PC1=PC1 PC2=PC2 PC3=PC3_U_Core_h750vb PC4=PC4 PC5=FS PD2=A0_1 PD3=A1_1 PD6=A0_2 PD7=A1_2
U_Core_h750vb: designators end in _U_Core_h750vb#2; ports PA0=PA0_U_Core_h750vb PA1=PA1_U_Core_h750vb PA2=PA2 PA3=PA3 PA4=PA4_U_Core_h750vb PA5=PA5 PA6=FSYN PA7=PA7 PB0=PB0 PB1=PB1_U_Core_h750vb PB3=PB3 PB4=~{CS} PB5=PB5 PC0=PC0_U_Core_h750vb PC1=PC1_U_Core_h750vb PC2=PC2_U_Core_h750vb PC3=PC3_U_Core_h750vb PC4=PC4 PC5=FS PD2=A0_1 PD3=A1_1 PD6=A0_2 PD7=A1_2

### Notes on the sheet
- Labels drawn without touching a wire or pin: A, B, S
- Title
- Size:
- Date:
- A3
- Number:
- Time:
- Revision:
- Sheet
- of
- File:

### Library data of the parts
C32 C36-C39 C42-C45 C48 C49 = 0603 100nF (104) 10% 50V: 贴片电容; ComponentLink1Description: 供应商链接; ComponentLink1URL: http://www.szlcsc.com/product/details_15331.html; Package: 0603; Supplier: LC; SuppliersPartNumber: C14663
C40 C41 = 0603 10uF (106) 10% 10V: 贴片电容; ComponentLink1Description: 供应商链接; ComponentLink1URL: http://www.szlcsc.com/product/details_20411.html; Package: 0603; Supplier: LC; SuppliersPartNumber: C19702
C50-C57 C60-C65 = C: 无极性贴片电容; 淘宝ID: 黄晶宝石; BOM名称: 无极性贴片电容; 学习资源: https://shop463601444.taobao.com
D7 D8 = 0603 蓝灯: 发光二极管; ComponentLink1Description: 供应商链接; ComponentLink1URL: http://www.szlcsc.com/product/details_73150.html; Package: 0603; Supplier: LC; SuppliersPartNumber: C72041
D9 = 0603 红灯: 发光二极管; ComponentLink1Description: 供应商链接; ComponentLink1URL: http://www.szlcsc.com/product/details_2659.html; Package: 0603; Supplier: LC; SuppliersPartNumber: C2286
JTAG/SW1 P1 = Header 3: Header, 3-Pin; LatestRevisionDate: 17-Jul-2002; LatestRevisionNote: Re-released for DXP Platform.; Publisher: Altium Limited
K1-K8 S1 S2 = SW-PB: 微动开关; Published: 24-Mar-1999; LatestRevisionDate: 17-Jul-2002; LatestRevisionNote: Re-released for DXP Platform.; PackageReference: SPST-2; Publisher: Altium Limited
M1-M5 = ELSE_M3_screw: 螺丝
R19-R23 = 0603 10KΩ (1002) 1%: 贴片电阻; ComponentLink1Description: 供应商链接; ComponentLink1URL: http://www.szlcsc.com/product/details_26547.html; Package: 0603; Supplier: LC; SuppliersPartNumber: C25804
R24-R31 R34-R43 R75-R78 = Res1: 贴片电阻; Published: 8-Jun-2000; LatestRevisionDate: 17-Jul-2002; LatestRevisionNote: Re-released for DXP Platform.; PackageReference: AXIAL-0.4; Publisher: Altium Limited; Value: 10K
SW1 SW2 = SWTICH_EC11_ENCODER
U5 = IC_STM32H750xB
Y1 = CRYSTAL_晶振25M_3225

## Sheet power.SchDoc
size A4 portrait
Used 2 times, as channels U_power, U_power. Parts and nets are listed once, with the designators drawn on the sheet.
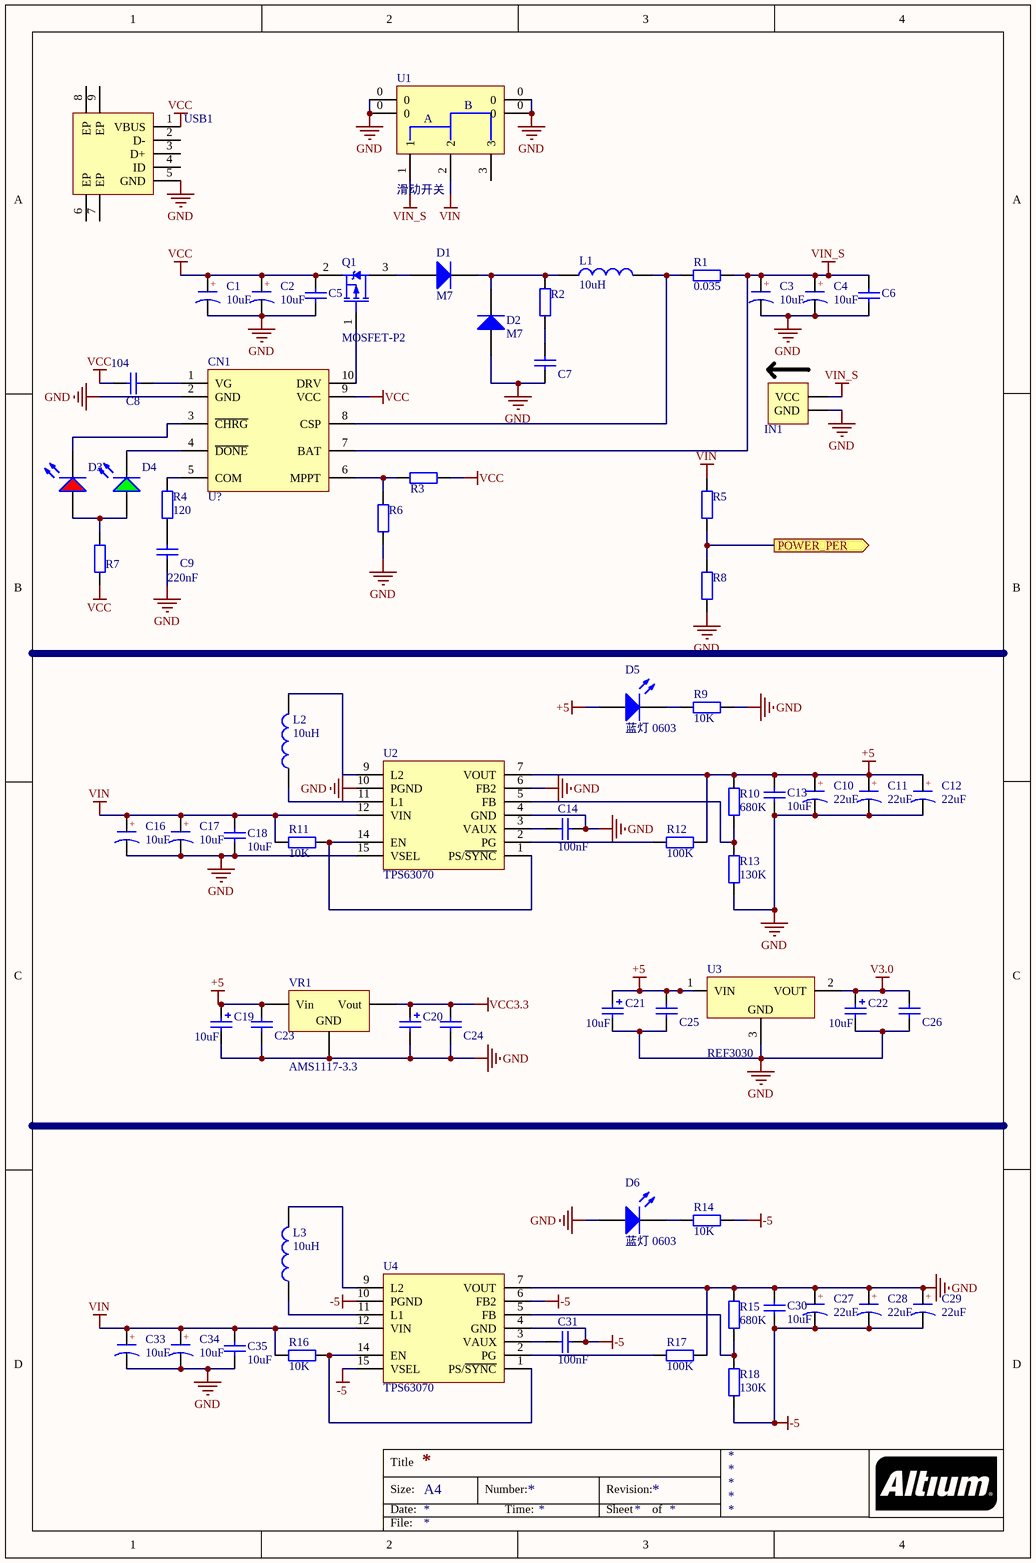
[diagram p6: power.SchDoc]

### Parts
C1  value 10uF  [226C]  (hidden comment: CAP+)
C2  value 10uF  [226C]  (hidden comment: CAP+)
C3  value 10uF  [226C]  (hidden comment: CAP+)
C4  value 10uF  [226C]  (hidden comment: CAP+)
C5  10nF (103) 10% 50V  [0603_C]  (value not drawn)
C6  10nF (103) 10% 50V  [0603_C]  (value not drawn)
C7  10nF (103) 10% 50V  [0603_C]  (value not drawn)
C8  104  [0603_C]
C9  220nF  [0603_C]
C10  value 22uF  [226C]  (hidden comment: CAP+)
C11  value 22uF  [226C]  (hidden comment: CAP+)
C12  value 22uF  [226C]  (hidden comment: CAP+)
C13  10uF  [0603_C]
C14  100nF  [0603_C]
C16  value 10uF  [226C]  (hidden comment: CAP+)
C17  value 10uF  [226C]  (hidden comment: CAP+)
C18  10uF  [0603_C]
C19  10uF  [CASE-A_3216]
C20  10uF (106) ±10% 16V  [CASE-A_3216]  (value not drawn)
C21  10uF  [CASE-A_3216]
C22  10uF  [CASE-A_3216]
C23  100nF (104) 10% 50V  [0603_C]  (value not drawn)
C24  100nF (104) 10% 50V  [0603_C]  (value not drawn)
C25  100nF (104) 10% 50V  [0603_C]  (value not drawn)
C26  100nF (104) 10% 50V  [0603_C]  (value not drawn)
C27  value 22uF  [226C]  (hidden comment: CAP+)
C28  value 22uF  [226C]  (hidden comment: CAP+)
C29  value 22uF  [226C]  (hidden comment: CAP+)
C30  10uF  [0603_C]
C31  100nF  [0603_C]
C33  value 10uF  [226C]  (hidden comment: CAP+)
C34  value 10uF  [226C]  (hidden comment: CAP+)
C35  10uF  [0603_C]
CN1  U?  [SSOP_10]
D1  M7  [SMA(DO-214AC)_S1]
D2  M7  [SMA(DO-214AC)_S1]
D3  红灯 0603  [0603_LED_S1]  (value not drawn)
D4  绿灯 0603  [0603_LED_S1]  (value not drawn)
D5  蓝灯 0603  [0603_LED_S1]
D6  蓝灯 0603  [0603_LED_S1]
IN1  HDR-1X2  [Power_IN_3.81-2P]  (value not drawn)
L1  value 10uH  [L8*8*4]  (hidden comment: IND)
L2  value 10uH  [L_6*6*2]  (hidden comment: IND)
L3  value 10uH  [L_6*6*2]  (hidden comment: IND)
Q1  MOSFET-P2  [SOT23-3M]
R1  0.035  [R 2512_L]
R2  100Ω (1000) ±1%  [0603_R]  (value not drawn)
R3  100Ω (1000) ±1%  [0603_R]  (value not drawn)
R4  120  [0603_R]
R5  100Ω (1000) ±1%  [0603_R]  (value not drawn)
R6  100Ω (1000) ±1%  [0603_R]  (value not drawn)
R7  100Ω (1000) ±1%  [0603_R]  (value not drawn)
R8  100Ω (1000) ±1%  [0603_R]  (value not drawn)
R9  10K  [0603_R]
R10  680K  [0603_R]
R11  10K  [0603_R]
R12  100K  [0603_R]
R13  130K  [0603_R]
R14  10K  [0603_R]
R15  680K  [0603_R]
R16  10K  [0603_R]
R17  100K  [0603_R]
R18  130K  [0603_R]
U1  滑动开关  [SW-SMD_3P-L6.6-W2.7-P1.50 - duplicate]
U2  TPS63070  [TPS63070]
U3  REF3030  [SOT23-3N]
U4  TPS63070  [TPS63070]
USB1  PORT_micro-5P破板式  [micro-5P破板式]  (value not drawn)
VR1  AMS1117-3.3  [SOT-223]

### Ports
POWER_PER (out)

### Nets
+5: C10.1(A) C11.1(A) C12.1(A) C13.2 C19.1 C21.1 C23.1 C25.1 D5.A R10.2 R12.1 U2.7(VOUT) U3.1(VIN) VR1.3(Vin)
-5: C27.2(K) C28.2(K) C29.2(K) C30.1 C31.1 R14.2 R18.1 U4.4(GND) U4.6(FB2) U4.10(PGND) U4.15(VSEL)
GND: C1.2(K) C2.2(K) C3.2(K) C4.2(K) C5.1 C6.1 C7.2 C9.2 C10.2(K) C11.2(K) C12.2(K) C13.1 C14.1 C16.2(K) C17.2(K) C18.1 C19.2 C20.2 C21.2 C22.2 C23.2 C24.2 C25.2 C26.2 C27.1(A) C28.1(A) C29.1(A) C30.2 C33.2(K) C34.2(K) C35.1 CN1.2(GND) D2.1(A) D6.A IN1.2(GND) R6.1 R8.1 R9.2 R13.1 R15.2 R17.1 U1.0 U2.4(GND) U2.6(FB2) U2.10(PGND) U2.15(VSEL) U3.3(GND) U4.7(VOUT) USB1.5(GND) VR1.1(GND)
V3.0: C22.1 C26.1 U3.2(VOUT)
VCC: C1.1(A) C2.1(A) C5.2 C8.2 CN1.9(VCC) Q1.2(S) R3.1 R7.2 USB1.1(VBUS)
VCC3.3: C20.1 C24.1 VR1.2(Vout)
VIN: C16.1(A) C17.1(A) C18.2 C33.1(A) C34.1(A) C35.2 R5.2 R11.1 R16.1 U1.2 U2.12(VIN) U4.12(VIN)
VIN_S: C3.1(A) C4.1(A) C6.2 CN1.7(BAT) IN1.1(VCC) R1.1 U1.1
POWER_PER: R5.1 R8.2 ; port POWER_PER
NetC7_1: C7.1 R2.1
NetC8_1: C8.1 CN1.1(VG)
NetC9_1: C9.1 R4.1
NetC14_2: C14.2 U2.3(VAUX)
NetC31_2: C31.2 U4.3(VAUX)
NetCN1_3: CN1.3(~{CHRG}) D3.K
NetCN1_4: CN1.4(~{DONE}) D4.K
NetCN1_5: CN1.5(COM) R4.2
NetCN1_6: CN1.6(MPPT) R3.2 R6.2
NetCN1_8: CN1.8(CSP) L1.2 R1.2
NetCN1_10: CN1.10(DRV) Q1.1(G)
NetD1_1: D1.1(A) Q1.3(D)
NetD1_2: D1.2(K) D2.2(K) L1.1 R2.2
NetD3_A: D3.A D4.A R7.1
NetD5_K: D5.K R9.1
NetD6_K: D6.K R14.1
NetL2_1: L2.1 U2.11(L1)
NetL2_2: L2.2 U2.9(L2)
NetL3_1: L3.1 U4.11(L1)
NetL3_2: L3.2 U4.9(L2)
NetR10_1: R10.1 R13.2 U2.5(FB)
NetR11_2: R11.2 U2.1(PS/~{SYNC}) U2.14(EN)
NetR12_2: R12.2 U2.2(PG)
NetR15_1: R15.1 R18.2 U4.5(FB)
NetR16_2: R16.2 U4.1(PS/~{SYNC}) U4.14(EN)
NetR17_2: R17.2 U4.2(PG)

Not connected (* = marked no-connect by the designer): U1 3; USB1 2(D-) 3(D+) 4(ID) 6(EP) 7(EP) 8(EP) 9(EP)

### Channels
U_power: designators end in _U_power#1; ports POWER_PER=PC1
U_power: designators end in _U_power#2; ports POWER_PER=NetR5_U_power#2_1

### Notes on the sheet
- Title
- Size:
- Date:
- A4
- Number:
- Time:
- Revision:
- Sheet
- of
- File:
- (in symbol 0CAP+) +
- (in symbol TA_6.6*2.7*2.5_滑动开关) B; A

### Library data of the parts
C1-C4 C10-C12 C16 C17 C27-C29 C33 C34 = 0CAP+: 贴片钽电容
C5-C9 = 0603 10nF (103) 10% 50V: 贴片电容; ComponentLink1Description: 供应商链接; ComponentLink1URL: http://www.szlcsc.com/product/details_58143.html; Package: 0603; Supplier: LC; SuppliersPartNumber: C57112
C13 C14 C18 C30 C31 C35 = 0603 10uF (106) 10% 10V: 贴片电容; ComponentLink1Description: 供应商链接; ComponentLink1URL: http://www.szlcsc.com/product/details_20411.html; Package: 0603; Supplier: LC; SuppliersPartNumber: C19702
C19-C22 = 3216 10uF (106) 10% 16V: 钽电容; ComponentLink1Description: 供应商链接; ComponentLink1URL: http://www.szlcsc.com/product/details_7643.html; Package: 3216; Supplier: LC; SuppliersPartNumber: C7171
C23-C26 = 0603 100nF (104) 10% 50V: 贴片电容; ComponentLink1Description: 供应商链接; ComponentLink1URL: http://www.szlcsc.com/product/details_15331.html; Package: 0603; Supplier: LC; SuppliersPartNumber: C14663
CN1 = CN3791
D1 D2 = SMA(DO-214AC) M7: 二极管; Notepad: 1N4007 4007 编号C2464 已经停售, 使用新物料编号C95872; ComponentLink1Description: 供应商链接; ComponentLink1URL: http://www.szlcsc.com/product/details_2841.html; Package: SMA(DO-214AC); Supplier: LC; SuppliersPartNumber: C95872
D3 = 0603 红灯: 发光二极管; ComponentLink1Description: 供应商链接; ComponentLink1URL: http://www.szlcsc.com/product/details_2659.html; Package: 0603; Supplier: LC; SuppliersPartNumber: C2286
D4 = 0603 绿灯: 发光二极管; ComponentLink1Description: 供应商链接; ComponentLink1URL: http://www.szlcsc.com/product/details_73152.html; Package: 0603; Supplier: LC; SuppliersPartNumber: C72043
D5 D6 = 0603 蓝灯: 发光二极管; ComponentLink1Description: 供应商链接; ComponentLink1URL: http://www.szlcsc.com/product/details_73150.html; Package: 0603; Supplier: LC; SuppliersPartNumber: C72041
IN1 = PORT_Power_IN2: 2P接插件,模块单电源供电口; 版权归属: 源创客; BOM名称: 2P接插件; 学习资源: www.ooocke.com
L1-L3 = 0IND: 小功率贴片电感
Q1 = MOS_MOSFET-P2: P-Channel MOSFET; PackageDocument: 1995/1996; Published: 8-Jun-2000; LatestRevisionDate: 17-Jul-2002; LatestRevisionNote: Re-released for DXP Platform.; PackageReference: E3; Publisher: Altium Limited
R1-R8 = 0603 100Ω (1000) 1%: 贴片电阻; ComponentLink1Description: 供应商链接; ComponentLink1URL: http://www.szlcsc.com/product/details_23502.html; Package: 0603; Supplier: LC; SuppliersPartNumber: C22775
R9-R18 = 0603 1.2KΩ (1201) 1%: 贴片电阻; ComponentLink1Description: 供应商链接; ComponentLink1URL: http://www.szlcsc.com/product/details_23492.html; Package: 0603; Supplier: LC; SuppliersPartNumber: C22765
U1 = TA_6.6*2.7*2.5_滑动开关
U3 = REF3040
VR1 = SOT-223 AMS1117-3.3: 低压差线性稳压(LDO); ComponentLink1Description: 供应商链接; ComponentLink1URL: http://www.szlcsc.com/product/details_6652.html; Package: SOT-223; Supplier: LC; SuppliersPartNumber: C6186

## Sheet Sheet1.SchDoc
size A4
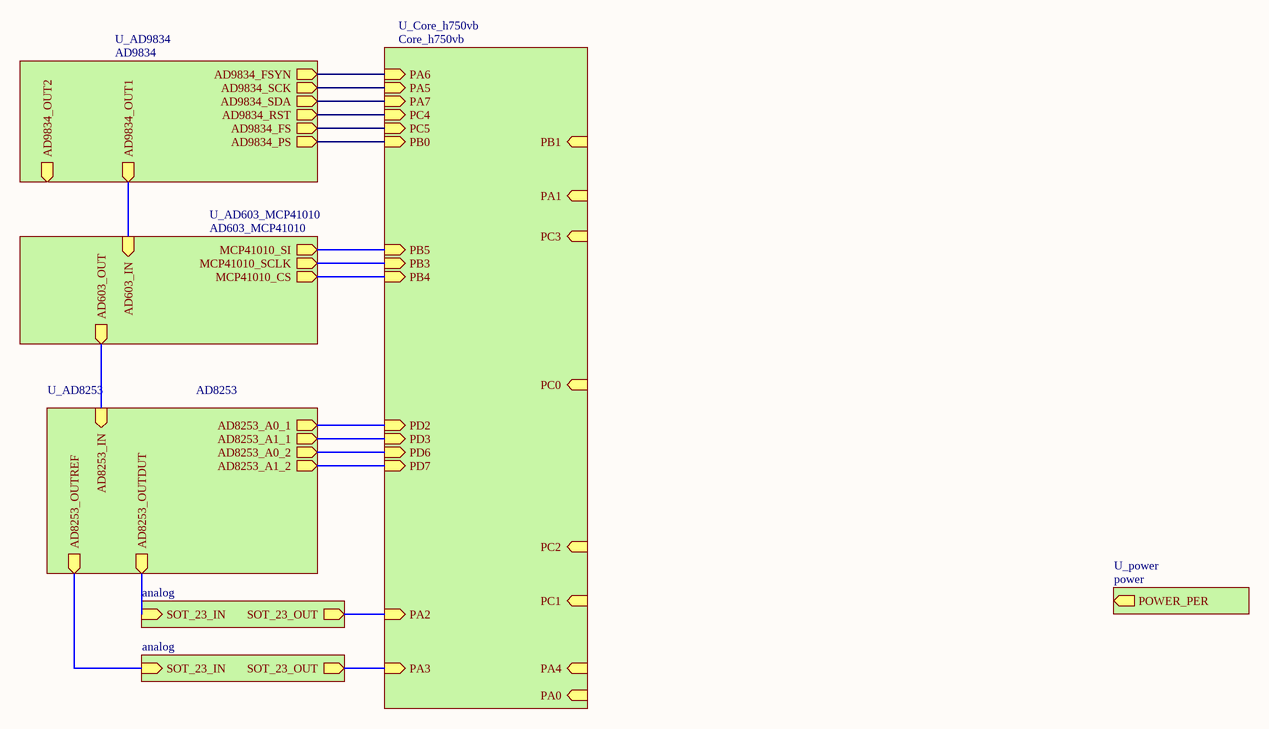
[diagram p7: Sheet1.SchDoc]

### Sub-sheets
U_AD603_MCP41010 = AD603_MCP41010: AD603_OUT (out), MCP41010_SI (out), MCP41010_SCLK (out), MCP41010_CS (out), AD603_IN (in)
U_AD8253 = AD8253: AD8253_A0_1 (out), AD8253_A1_1 (out), AD8253_A0_2 (out), AD8253_A1_2 (out), AD8253_OUTDUT (out), AD8253_OUTREF (out), AD8253_IN (in)
U_AD9834 = AD9834: AD9834_FSYN (out), AD9834_SCK (out), AD9834_SDA (out), AD9834_RST (out), AD9834_FS (out), AD9834_PS (out), AD9834_OUT1 (out), AD9834_OUT2 (out)
U_Core_h750vb = Core_h750vb: PA6 (in), PA5 (in), PA7 (in), PC4 (in), PC5 (in), PB0 (in), PB5 (in), PB3 (in), PD2 (in), PD3 (in), PD6 (in), PD7 (in), PA1 (in), PA2 (in), PA3 (in), PC0 (in), PC1 (in), PC2 (in), PC3 (in), PA0 (in), PB1 (in), PB4 (in), PA4 (in)
U_power = power: POWER_PER (out)
? = analog: SOT_23_IN (in), SOT_23_OUT (out)
? = analog: SOT_23_IN (in), SOT_23_OUT (out)

### Nets
A0_1: sheet U_AD8253/AD8253_A0_1, sheet U_Core_h750vb/PD2
A0_2: sheet U_AD8253/AD8253_A0_2, sheet U_Core_h750vb/PD6
A1_1: sheet U_AD8253/AD8253_A1_1, sheet U_Core_h750vb/PD3
A1_2: sheet U_AD8253/AD8253_A1_2, sheet U_Core_h750vb/PD7
AD603_IN: sheet U_AD603_MCP41010/AD603_IN, sheet U_AD9834/AD9834_OUT1
AD603_OUT: sheet U_AD603_MCP41010/AD603_OUT, sheet U_AD8253/AD8253_IN
AD8253_OUTDUT: sheet U_AD8253/AD8253_OUTDUT, sheet /SOT_23_IN
AD8253_OUTREF: sheet U_AD8253/AD8253_OUTREF, sheet /SOT_23_IN
~{CS}: sheet U_AD603_MCP41010/MCP41010_CS, sheet U_Core_h750vb/PB4
FS: sheet U_AD9834/AD9834_FS, sheet U_Core_h750vb/PC5
FSYN: sheet U_AD9834/AD9834_FSYN, sheet U_Core_h750vb/PA6
PA2: sheet U_Core_h750vb/PA2, sheet /SOT_23_OUT
PA3: sheet U_Core_h750vb/PA3, sheet /SOT_23_OUT
PA5: sheet U_AD9834/AD9834_SCK, sheet U_Core_h750vb/PA5
PA7: sheet U_AD9834/AD9834_SDA, sheet U_Core_h750vb/PA7
PB0: sheet U_AD9834/AD9834_PS, sheet U_Core_h750vb/PB0
PB3: sheet U_AD603_MCP41010/MCP41010_SCLK, sheet U_Core_h750vb/PB3
PB5: sheet U_AD603_MCP41010/MCP41010_SI, sheet U_Core_h750vb/PB5
PC4: sheet U_AD9834/AD9834_RST, sheet U_Core_h750vb/PC4

## Nets that join several sheets
+5: U_AD603_MCP41010 (8 pins), U_AD8253 (8 pins), U_AD9834 (C84_U_AD9834#1.1 C96_U_AD9834#1.2 R67_U_AD9834#1.1 U10_U_AD9834#1.4),  (C15_#1.2 IC1_#1.5 R69_#1.2), U_Core_h750vb (LCD1_U_Core_h750vb#1.28), U_power (14 pins),  (C15_#2.2 IC1_#2.5 R69_#2.2),  (C15_#3.2 IC1_#3.5 R69_#3.2),  (C15_#4.2 IC1_#4.5 R69_#4.2),  (C15_#5.2 IC1_#5.5 R69_#5.2),  (C15_#6.2 IC1_#6.5 R69_#6.2), U_AD603_MCP41010 (8 pins), U_AD8253 (8 pins), U_AD9834 (C84_U_AD9834#2.1 C96_U_AD9834#2.2 R67_U_AD9834#2.1 U10_U_AD9834#2.4), U_Core_h750vb (LCD1_U_Core_h750vb#2.28), U_power (14 pins),  (C15_#7.2 IC1_#7.5 R69_#7.2),  (C15_#8.2 IC1_#8.5 R69_#8.2)
-5: U_AD603_MCP41010 (C73_U_AD603_MCP41010#1.1 R53_U_AD603_MCP41010#1.1 U8_U_AD603_MCP41010#1.6), U_AD8253 (6 pins), U_power (11 pins), U_AD603_MCP41010 (C73_U_AD603_MCP41010#2.1 R53_U_AD603_MCP41010#2.1 U8_U_AD603_MCP41010#2.6), U_AD8253 (6 pins), U_power (11 pins)
DGND: U_AD9834 (C90_U_AD9834#1.1 U10_U_AD9834#1.7 Y2_U_AD9834#1.2), U_Core_h750vb (56 pins), U_AD9834 (C90_U_AD9834#2.1 U10_U_AD9834#2.7 Y2_U_AD9834#2.2), U_Core_h750vb (56 pins)
GND: Main (AD603.2 ADIN3.2 ADIN4.2 DAOUT1.2), U_AD603_MCP41010 (9 pins), U_AD8253 (11 pins), U_AD9834 (18 pins),  (5 pins), U_Core_h750vb (5 pins), U_power (50 pins),  (5 pins),  (5 pins),  (5 pins),  (5 pins),  (5 pins), U_AD603_MCP41010 (9 pins), U_AD8253 (11 pins), U_AD9834 (18 pins), U_Core_h750vb (5 pins), U_power (50 pins),  (5 pins),  (5 pins)
V3.0: U_Core_h750vb (U5_U_Core_h750vb#1.20), U_power (C22_U_power#1.1 C26_U_power#1.1 U3_U_power#1.2), U_Core_h750vb (U5_U_Core_h750vb#2.20), U_power (C22_U_power#2.1 C26_U_power#2.1 U3_U_power#2.2)
VCC: U_power (9 pins), U_power (9 pins)
VCC3.3: U_AD9834 (C90_U_AD9834#1.2 Y2_U_AD9834#1.4), U_Core_h750vb (37 pins), U_power (C20_U_power#1.1 C24_U_power#1.1 VR1_U_power#1.2), U_AD9834 (C90_U_AD9834#2.2 Y2_U_AD9834#2.4), U_Core_h750vb (37 pins), U_power (C20_U_power#2.1 C24_U_power#2.1 VR1_U_power#2.2)
VIN: U_power (12 pins), U_power (12 pins)
VIN_S: U_power (7 pins), U_power (7 pins)
A0_1: U_AD8253 (R44_U_AD8253#1.1 U6_U_AD8253#1.4), U_Core_h750vb (U5_U_Core_h750vb#1.83)
A0_1: U_AD8253 (R44_U_AD8253#2.1 U6_U_AD8253#2.4), U_Core_h750vb (U5_U_Core_h750vb#2.83)
A0_2: U_AD8253 (R46_U_AD8253#1.1 U7_U_AD8253#1.4), U_Core_h750vb (U5_U_Core_h750vb#1.87)
A0_2: U_AD8253 (R46_U_AD8253#2.1 U7_U_AD8253#2.4), U_Core_h750vb (U5_U_Core_h750vb#2.87)
A1_1: U_AD8253 (R45_U_AD8253#1.1 U6_U_AD8253#1.5), U_Core_h750vb (U5_U_Core_h750vb#1.84)
A1_1: U_AD8253 (R45_U_AD8253#2.1 U6_U_AD8253#2.5), U_Core_h750vb (U5_U_Core_h750vb#2.84)
A1_2: U_AD8253 (R48_U_AD8253#1.1 U7_U_AD8253#1.5), U_Core_h750vb (U5_U_Core_h750vb#1.88)
A1_2: U_AD8253 (R48_U_AD8253#2.1 U7_U_AD8253#2.5), U_Core_h750vb (U5_U_Core_h750vb#2.88)
AD603_IN: U_AD603_MCP41010 (U8_U_AD603_MCP41010#1.3), U_AD9834 (R65_U_AD9834#1.2)
AD603_IN: U_AD603_MCP41010 (U8_U_AD603_MCP41010#2.3), U_AD9834 (R59_U_AD9834#2.2)
AD603_OUT: Main (AD603.1), U_AD603_MCP41010 (C74_U_AD603_MCP41010#1.1 R52_U_AD603_MCP41010#1.2),  (C98_#5.1)
AD603_OUT: U_AD603_MCP41010 (C74_U_AD603_MCP41010#2.1 R52_U_AD603_MCP41010#2.2), U_AD8253 (P3_U_AD8253#2.1)
AD8253_IN: U_AD8253 (P3_U_AD8253#1.1), U_AD9834 (R59_U_AD9834#1.2),  (C98_#6.1)
AD8253_OUTDUT: U_AD8253 (U6_U_AD8253#1.7),  (C98_#3.1)
AD8253_OUTDUT: U_AD8253 (U6_U_AD8253#2.7),  (C98_#7.1)
AD8253_OUTREF: U_AD8253 (U7_U_AD8253#1.7),  (C98_#4.1)
AD8253_OUTREF: U_AD8253 (U7_U_AD8253#2.7),  (C98_#8.1)
~{CS}: U_AD603_MCP41010 (R57_U_AD603_MCP41010#1.2 U9_U_AD603_MCP41010#1.1), U_Core_h750vb (U5_U_Core_h750vb#1.90)
~{CS}: U_AD603_MCP41010 (R57_U_AD603_MCP41010#2.2 U9_U_AD603_MCP41010#2.1), U_Core_h750vb (U5_U_Core_h750vb#2.90)
FS: U_AD9834 (U10_U_AD9834#1.9), U_Core_h750vb (U5_U_Core_h750vb#1.33)
FS: U_AD9834 (U10_U_AD9834#2.9), U_Core_h750vb (U5_U_Core_h750vb#2.33)
FSYN: U_AD9834 (U10_U_AD9834#1.15), U_Core_h750vb (U5_U_Core_h750vb#1.30)
FSYN: U_AD9834 (U10_U_AD9834#2.15), U_Core_h750vb (U5_U_Core_h750vb#2.30)
PA0: U_Core_h750vb (U5_U_Core_h750vb#1.22),  (R70_#5.2 R72_#5.2)
PA1: U_Core_h750vb (U5_U_Core_h750vb#1.23),  (R70_#6.2 R72_#6.2)
PA2: U_Core_h750vb (U5_U_Core_h750vb#1.24),  (R70_#3.2 R72_#3.2)
PA2: U_Core_h750vb (U5_U_Core_h750vb#2.24),  (R70_#7.2 R72_#7.2)
PA3: U_Core_h750vb (U5_U_Core_h750vb#1.25),  (R70_#4.2 R72_#4.2)
PA3: U_Core_h750vb (U5_U_Core_h750vb#2.25),  (R70_#8.2 R72_#8.2)
PA4: Main (DAOUT1.1), U_Core_h750vb (U5_U_Core_h750vb#1.28)
PA5: U_AD9834 (U10_U_AD9834#1.14), U_Core_h750vb (U5_U_Core_h750vb#1.29)
PA5: U_AD9834 (U10_U_AD9834#2.14), U_Core_h750vb (U5_U_Core_h750vb#2.29)
PA7: U_AD9834 (U10_U_AD9834#1.13), U_Core_h750vb (U5_U_Core_h750vb#1.31)
PA7: U_AD9834 (U10_U_AD9834#2.13), U_Core_h750vb (U5_U_Core_h750vb#2.31)
PB0: U_AD9834 (U10_U_AD9834#1.10), U_Core_h750vb (U5_U_Core_h750vb#1.34)
PB0: U_AD9834 (U10_U_AD9834#2.10), U_Core_h750vb (U5_U_Core_h750vb#2.34)
PB3: U_AD603_MCP41010 (R56_U_AD603_MCP41010#1.2 U9_U_AD603_MCP41010#1.2), U_Core_h750vb (U5_U_Core_h750vb#1.89)
PB3: U_AD603_MCP41010 (R56_U_AD603_MCP41010#2.2 U9_U_AD603_MCP41010#2.2), U_Core_h750vb (U5_U_Core_h750vb#2.89)
PB5: U_AD603_MCP41010 (R55_U_AD603_MCP41010#1.2 U9_U_AD603_MCP41010#1.3), U_Core_h750vb (U5_U_Core_h750vb#1.91)
PB5: U_AD603_MCP41010 (R55_U_AD603_MCP41010#2.2 U9_U_AD603_MCP41010#2.3), U_Core_h750vb (U5_U_Core_h750vb#2.91)
PC0: U_Core_h750vb (U5_U_Core_h750vb#1.15),  (R70_#2.2 R72_#2.2)
PC1: U_Core_h750vb (U5_U_Core_h750vb#1.16), U_power (R5_U_power#1.1 R8_U_power#1.2)
PC2:  (R70_#1.2 R72_#1.2), U_Core_h750vb (U5_U_Core_h750vb#1.17)
PC4: U_AD9834 (U10_U_AD9834#1.11), U_Core_h750vb (U5_U_Core_h750vb#1.32)
PC4: U_AD9834 (U10_U_AD9834#2.11), U_Core_h750vb (U5_U_Core_h750vb#2.32)
SOT_23_IN: Main (ADIN3.1),  (C98_#2.1)
SOT_23_IN: Main (ADIN4.1),  (C98_#1.1)